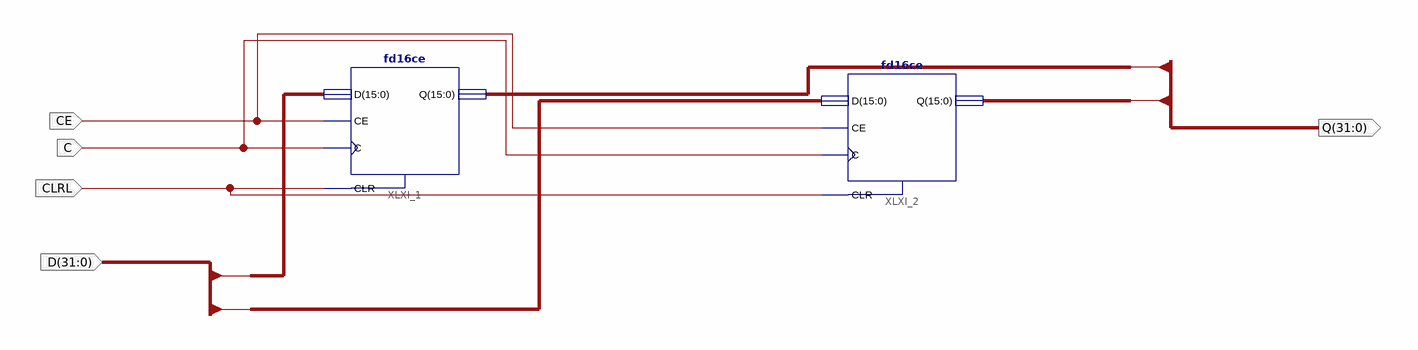
[diagram p0: schematic sheet 1]
// Xilinx ISE schematic register_32b.sch (spartan3) as structural Verilog: 2 symbols, 5 ports
module register_32b (
  input  [31:0] D,
  input  CE,
  input  C,
  input  CLRL,
  output [31:0] Q
);

  fd16ce XLXI_1 (.C(C), .CE(CE), .CLR(CLRL), .D(D[15:0]), .Q(Q[15:0]));
  fd16ce XLXI_2 (.C(C), .CE(CE), .CLR(CLRL), .D(D[31:16]), .Q(Q[31:16]));
endmodule
